# Altium schematic sheet 电机驱动.SchDoc
size A4
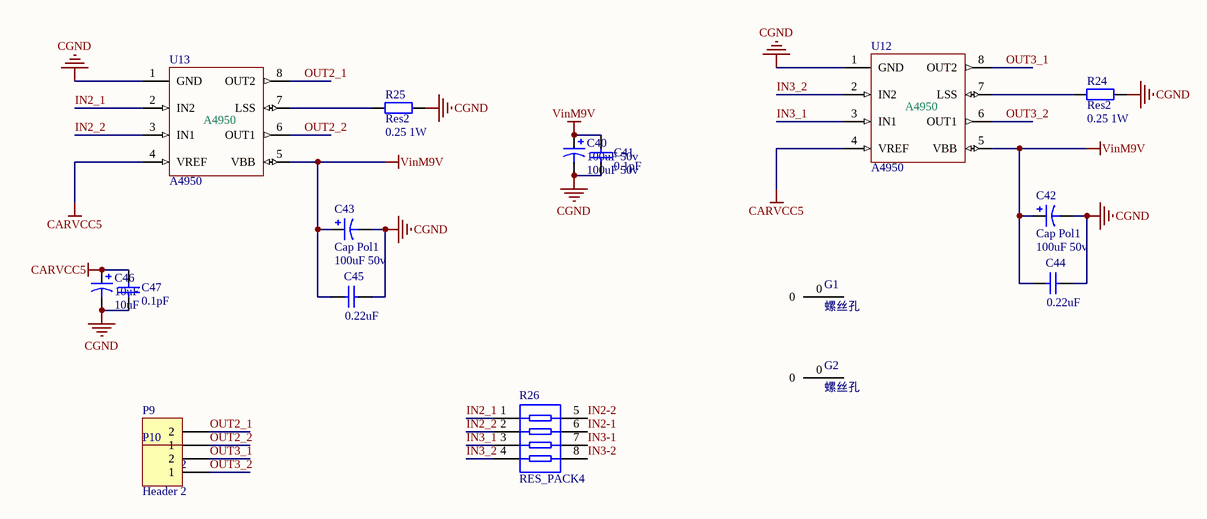
[diagram p0: 电机驱动.SchDoc]

## Parts
C40  100uF 50v  [电容HONOR_63X77]
C41  value 0.1pF  [LC-0603_C]  (hidden comment: Cap)
C42  Cap Pol1  value 100uF 50v  [100UF]
C43  Cap Pol1  value 100uF 50v  [100UF]
C44  value 0.22uF  [LC-0603_C]
C45  value 0.22uF  [LC-0603_C]
C46  10uF  [电容HONOR_63X77]
C47  value 0.1pF  [LC-0603_C]  (hidden comment: Cap)
G1  螺丝孔  [M3螺丝孔]
G2  螺丝孔  [M3螺丝孔]
P9  Header 2  [HDR1X2]
P10  Header 2  [HDR1X2]
R24  Res2  value 0.25 1W  [LC-2512_R]
R25  Res2  value 0.25 1W  [LC-2512_R]
R26  RES_PACK4  [RES4]
U12  A4950  [LC-SOIC-8_150mil]
U13  A4950  [LC-SOIC-8_150mil]

## Nets
CARVCC5: C46.1 C47.1 U12.4(VREF) U13.4(VREF)
CGND: C40.2 C41.2 C42.2 C43.2 C44.2 C45.2 C46.2 C47.2 R24.2 R25.2 U12.1(GND) U13.1(GND)
VinM9V: C40.1 C41.1 C42.1 C43.1 C44.1 C45.1 U12.5(VBB) U13.5(VBB)
IN2-1: R26.6
IN2-2: R26.5
IN2_1: R26.1 U13.2(IN2)
IN2_2: R26.2 U13.3(IN1)
IN3-1: R26.7
IN3-2: R26.8
IN3_1: R26.3 U12.3(IN1)
IN3_2: R26.4 U12.2(IN2)
OUT2_1: P9.2 U13.8(OUT2)
OUT2_2: P9.1 U13.6(OUT1)
OUT3_1: P10.2 U12.8(OUT2)
OUT3_2: P10.1 U12.6(OUT1)
NetR24_1: R24.1 U12.7(LSS)
NetR25_1: R25.1 U13.7(LSS)

Not connected (* = marked no-connect by the designer): G1 0; G2 0

## Library data of the parts
C40 C42 C43 C46 = Cap Pol1: Polarized Capacitor (Radial); Published: 8-Jun-2000; LatestRevisionDate: 17-Jul-2002; LatestRevisionNote: Re-released for DXP Platform.; PackageReference: RB7.6-15; Publisher: Altium Limited
  C40: Value: 100uF 50v
  C46: Value: 10uF
C41 C44 C45 C47 = Cap: Capacitor; Published: 8-Jun-2000; LatestRevisionDate: 17-Jul-2002; LatestRevisionNote: Re-released for DXP Platform.; PackageReference: RAD-0.3; Publisher: Altium Limited
P9 P10 = Header 2: Header, 2-Pin; LatestRevisionDate: 17-Jul-2002; LatestRevisionNote: Re-released for DXP Platform.; Publisher: Altium Limited
R24 R25 = Res2: Resistor; Published: 8-Jun-2000; LatestRevisionDate: 17-Jul-2002; LatestRevisionNote: Re-released for DXP Platform.; PackageReference: AXIAL-0.4; Publisher: Altium Limited